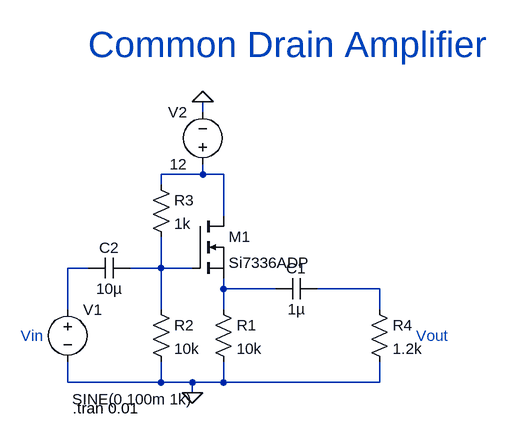
[diagram p0: schematic Common_Drain_amp.asc]
Common_Drain_amp.asc, the LTspice schematic file:
Version 4
SHEET 1 880 680
WIRE 208 -80 208 -96
WIRE 208 16 208 0
WIRE 208 16 144 16
WIRE 240 16 208 16
WIRE 144 32 144 16
WIRE 240 80 240 16
WIRE 32 160 0 160
WIRE 144 160 144 112
WIRE 144 160 96 160
WIRE 192 160 144 160
WIRE 240 192 240 176
WIRE 320 192 240 192
WIRE 480 192 384 192
WIRE 0 224 0 160
WIRE 144 224 144 160
WIRE 240 224 240 192
WIRE 480 224 480 192
WIRE 0 336 0 304
WIRE 144 336 144 304
WIRE 144 336 0 336
WIRE 192 336 144 336
WIRE 240 336 240 304
WIRE 240 336 192 336
WIRE 480 336 480 304
WIRE 480 336 240 336
WIRE 192 352 192 336
FLAG 208 -96 0
FLAG 192 352 0
SYMBOL res 224 208 R0
SYMATTR InstName R1
SYMATTR Value 10k
SYMBOL res 128 208 R0
SYMATTR InstName R2
SYMATTR Value 10k
SYMBOL res 128 16 R0
SYMATTR InstName R3
SYMATTR Value 1k
SYMBOL cap 384 176 R90
WINDOW 0 0 32 VBottom 2
WINDOW 3 32 32 VTop 2
SYMATTR InstName C1
SYMATTR Value 1µ
SYMBOL cap 96 144 R90
WINDOW 0 0 32 VBottom 2
WINDOW 3 32 32 VTop 2
SYMATTR InstName C2
SYMATTR Value 10µ
SYMBOL voltage 0 208 R0
WINDOW 3 7 154 Left 2
WINDOW 123 0 0 Left 0
WINDOW 39 0 0 Left 0
SYMATTR Value SINE(0 100m 1k)
SYMATTR InstName V1
SYMBOL voltage 208 16 R180
WINDOW 0 24 96 Left 2
WINDOW 3 24 16 Left 2
WINDOW 123 0 0 Left 0
WINDOW 39 0 0 Left 0
SYMATTR InstName V2
SYMATTR Value 12
SYMBOL res 464 208 R0
SYMATTR InstName R4
SYMATTR Value 1.2k
SYMBOL nmos 192 80 R0
SYMATTR InstName M1
SYMATTR Value Si7336ADP
TEXT 536 264 Left 2 ;Vout
TEXT 8 376 Left 2 !.tran 0.01
TEXT -72 264 Left 2 ;Vin
TEXT 32 -184 Left 5 ;Common Drain Amplifier

The netlist it stands for:
* Common_Drain_amp.asc
R1 N004 0 10k
R2 N003 0 10k
R3 N001 N003 1k
C1 N005 N004 1µ
C2 N003 N002 10µ
V1 N002 0 SINE(0 100m 1k)
V2 N001 0 12
R4 N005 0 1.2k
M1 N001 N003 N004 N004 Si7336ADP
.model NMOS NMOS
.model PMOS PMOS
.lib standard.mos
* Vout
.tran 0.01
* Vin
* Common Drain Amplifier
.backanno
.end